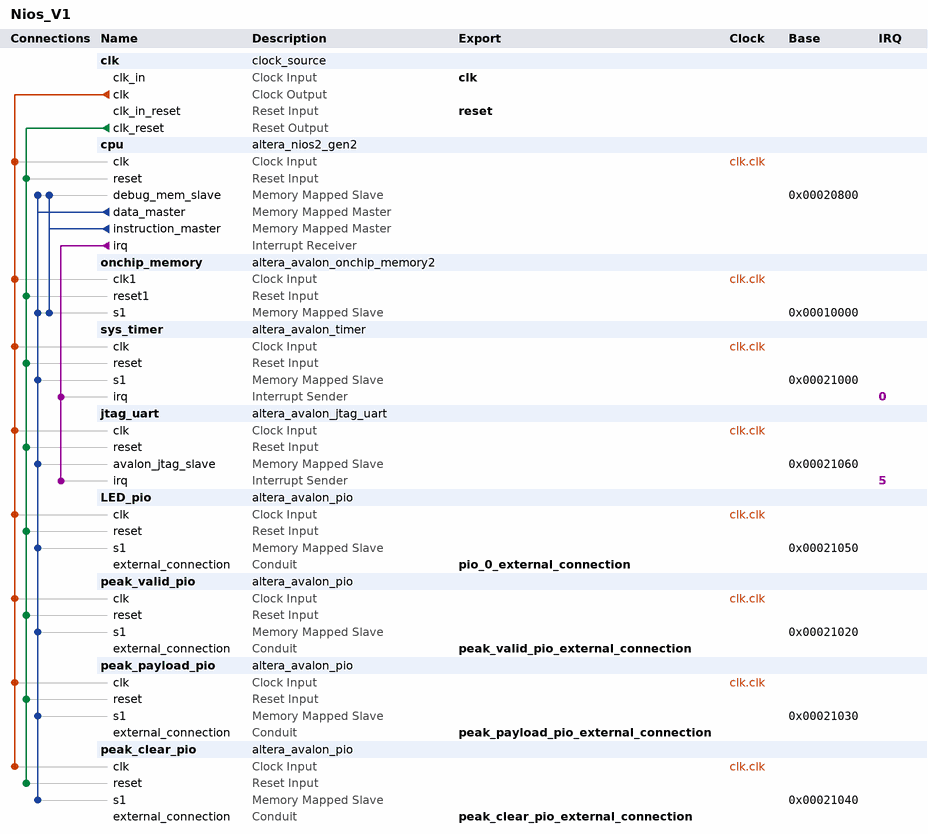
[diagram p0: system contents]
# Platform Designer (Qsys) system Nios_V1, Cyclone V 5CSEMA5F31C6
# Parameters at their usual value, and those the tool derives, are not listed.
package require -exact qsys 18.1
create_system Nios_V1
set_project_property DEVICE_FAMILY {Cyclone V}
set_project_property DEVICE 5CSEMA5F31C6

add_instance clk clock_source 18.1
set_instance_parameter_value clk clockFrequency 50000000

add_instance cpu altera_nios2_gen2 18.1
set_instance_parameter_value cpu cpuID 1
set_instance_parameter_value cpu dcache_size 2048
set_instance_parameter_value cpu exceptionSlave onchip_memory.s1
set_instance_parameter_value cpu icache_size 4096
set_instance_parameter_value cpu impl Fast
set_instance_parameter_value cpu resetSlave onchip_memory.s1

add_instance onchip_memory altera_avalon_onchip_memory2 18.1
set_instance_parameter_value onchip_memory dataWidth 32
set_instance_parameter_value onchip_memory dualPort false
set_instance_parameter_value onchip_memory initMemContent true
set_instance_parameter_value onchip_memory initializationFileName onchip_mem.hex
set_instance_parameter_value onchip_memory memorySize 65536

add_instance sys_timer altera_avalon_timer 18.1
set_instance_parameter_value sys_timer period 1
set_instance_parameter_value sys_timer periodUnits MSEC

add_instance jtag_uart altera_avalon_jtag_uart 18.1
set_instance_parameter_value jtag_uart simInteractiveOptions NO_INTERACTIVE_WINDOWS

add_instance LED_pio altera_avalon_pio 18.1
set_instance_parameter_value LED_pio direction Output
set_instance_parameter_value LED_pio width 8

add_instance peak_valid_pio altera_avalon_pio 18.1
set_instance_parameter_value peak_valid_pio direction Input
set_instance_parameter_value peak_valid_pio width 1

add_instance peak_payload_pio altera_avalon_pio 18.1
set_instance_parameter_value peak_payload_pio direction Input
set_instance_parameter_value peak_payload_pio width 32

add_instance peak_clear_pio altera_avalon_pio 18.1
set_instance_parameter_value peak_clear_pio direction Output
set_instance_parameter_value peak_clear_pio width 1

# connections
add_connection clk.clk cpu.clk clock
add_connection clk.clk jtag_uart.clk clock
add_connection clk.clk LED_pio.clk clock
add_connection clk.clk onchip_memory.clk1 clock
add_connection clk.clk peak_clear_pio.clk clock
add_connection clk.clk peak_payload_pio.clk clock
add_connection clk.clk peak_valid_pio.clk clock
add_connection clk.clk sys_timer.clk clock
add_connection clk.clk_reset cpu.reset reset
add_connection clk.clk_reset jtag_uart.reset reset
add_connection clk.clk_reset LED_pio.reset reset
add_connection clk.clk_reset onchip_memory.reset1 reset
add_connection clk.clk_reset peak_clear_pio.reset reset
add_connection clk.clk_reset peak_payload_pio.reset reset
add_connection clk.clk_reset peak_valid_pio.reset reset
add_connection clk.clk_reset sys_timer.reset reset
add_connection cpu.data_master cpu.debug_mem_slave avalon
set_connection_parameter_value cpu.data_master/cpu.debug_mem_slave baseAddress 0x00020800
add_connection cpu.data_master jtag_uart.avalon_jtag_slave avalon
set_connection_parameter_value cpu.data_master/jtag_uart.avalon_jtag_slave baseAddress 0x00021060
add_connection cpu.data_master LED_pio.s1 avalon
set_connection_parameter_value cpu.data_master/LED_pio.s1 baseAddress 0x00021050
add_connection cpu.data_master onchip_memory.s1 avalon
set_connection_parameter_value cpu.data_master/onchip_memory.s1 baseAddress 0x00010000
add_connection cpu.data_master peak_clear_pio.s1 avalon
set_connection_parameter_value cpu.data_master/peak_clear_pio.s1 baseAddress 0x00021040
add_connection cpu.data_master peak_payload_pio.s1 avalon
set_connection_parameter_value cpu.data_master/peak_payload_pio.s1 baseAddress 0x00021030
add_connection cpu.data_master peak_valid_pio.s1 avalon
set_connection_parameter_value cpu.data_master/peak_valid_pio.s1 baseAddress 0x00021020
add_connection cpu.data_master sys_timer.s1 avalon
set_connection_parameter_value cpu.data_master/sys_timer.s1 baseAddress 0x00021000
add_connection cpu.instruction_master cpu.debug_mem_slave avalon
set_connection_parameter_value cpu.instruction_master/cpu.debug_mem_slave baseAddress 0x00020800
add_connection cpu.instruction_master onchip_memory.s1 avalon
set_connection_parameter_value cpu.instruction_master/onchip_memory.s1 baseAddress 0x00010000
add_connection cpu.irq jtag_uart.irq interrupt
set_connection_parameter_value cpu.irq/jtag_uart.irq irqNumber 5
add_connection cpu.irq sys_timer.irq interrupt
set_connection_parameter_value cpu.irq/sys_timer.irq irqNumber 0

# exported interfaces
add_interface clk clock sink
set_interface_property clk EXPORT_OF clk.clk_in
add_interface peak_clear_pio_external_connection conduit end
set_interface_property peak_clear_pio_external_connection EXPORT_OF peak_clear_pio.external_connection
add_interface peak_payload_pio_external_connection conduit end
set_interface_property peak_payload_pio_external_connection EXPORT_OF peak_payload_pio.external_connection
add_interface peak_valid_pio_external_connection conduit end
set_interface_property peak_valid_pio_external_connection EXPORT_OF peak_valid_pio.external_connection
add_interface pio_0_external_connection conduit end
set_interface_property pio_0_external_connection EXPORT_OF LED_pio.external_connection
add_interface reset reset sink
set_interface_property reset EXPORT_OF clk.clk_in_reset

set_interconnect_requirement {$system} qsys_mm.clockCrossingAdapter HANDSHAKE
set_interconnect_requirement {$system} qsys_mm.enableEccProtection FALSE
set_interconnect_requirement {$system} qsys_mm.insertDefaultSlave FALSE
set_interconnect_requirement {$system} qsys_mm.maxAdditionalLatency 1

save_system Nios_V1.qsys
